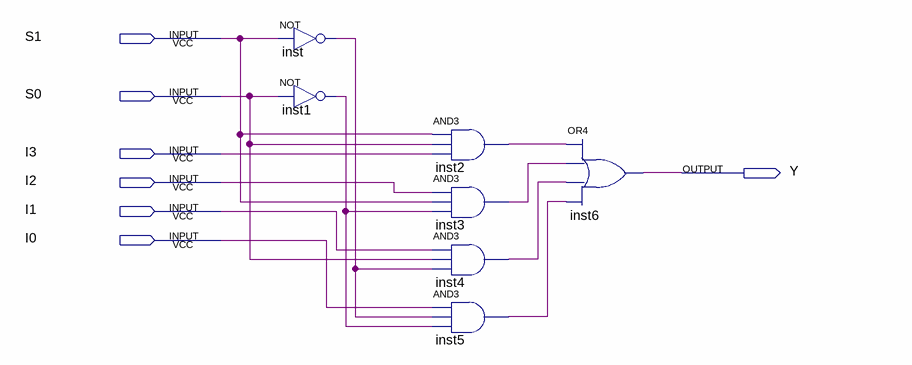
[diagram p0: schematic sheet]
// Quartus schematic MUX_4_1.bdf as structural Verilog: 7 symbols, 7 pins
module MUX_4_1 (
  input  S1,
  input  S0,
  input  I3,
  input  I2,
  input  I1,
  input  I0,
  output Y
);

  wire inst1_out, inst2_out, inst3_out, inst4_out, inst5_out, inst_out;

  not inst (inst_out, S1);
  not inst1 (inst1_out, S0);
  and inst2 (inst2_out, S1, S0, I3);
  and inst3 (inst3_out, I2, S1, inst1_out);
  and inst4 (inst4_out, I1, S0, inst_out);
  and inst5 (inst5_out, I0, inst_out, inst1_out);
  or inst6 (Y, inst2_out, inst3_out, inst4_out, inst5_out);
endmodule
